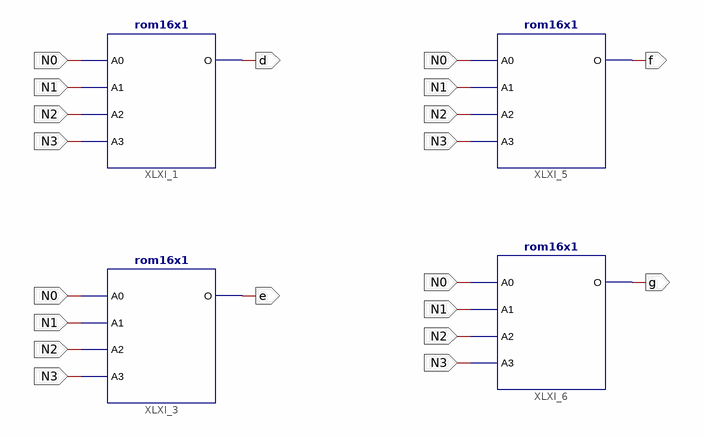
[diagram p0: schematic sheet 1]
// Xilinx ISE schematic Rom1.sch (spartan3e) as structural Verilog: 4 symbols, 8 ports
module Rom1 (
  input  N3,
  input  N2,
  input  N1,
  input  N0,
  output g,
  output f,
  output e,
  output d
);

  rom16x1 #(.INIT("1083")) XLXI_6 (.A0(N0), .A1(N1), .A2(N2), .A3(N3), .O(g));
  rom16x1 #(.INIT("208E")) XLXI_5 (.A0(N0), .A1(N1), .A2(N2), .A3(N3), .O(f));
  rom16x1 #(.INIT("02BA")) XLXI_3 (.A0(N0), .A1(N1), .A2(N2), .A3(N3), .O(e));
  rom16x1 #(.INIT("8492")) XLXI_1 (.A0(N0), .A1(N1), .A2(N2), .A3(N3), .O(d));
endmodule
